# Altium schematic sheet Att_steet_2.SchDoc
size A
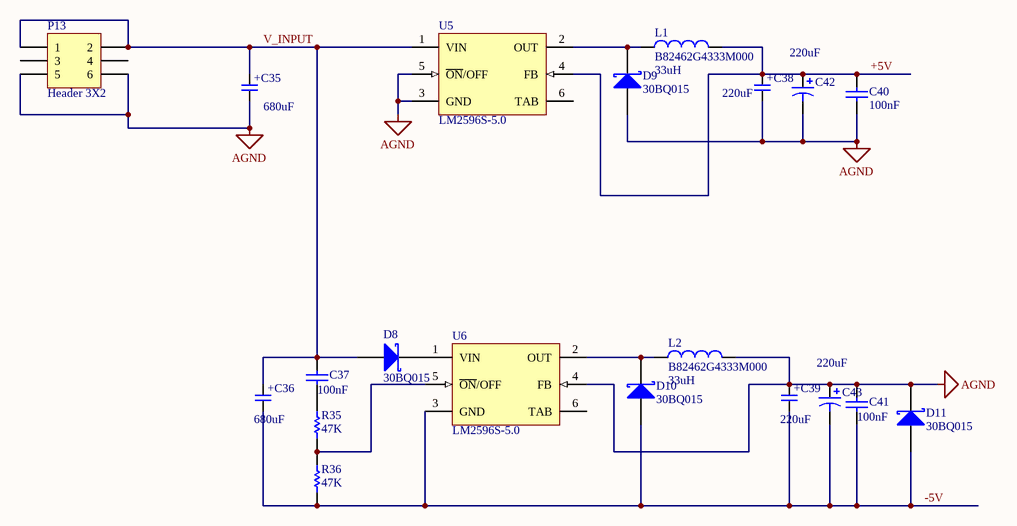
[diagram p0: Att_steet_2.SchDoc]

## Parts
C35  value 680uF  [H13]  (hidden comment: Cap)
C36  value 680uF  [H13]  (hidden comment: Cap)
C37  value 100nF  [0805]  (hidden comment: C0805)
C38  value 220uF  [H13]  (hidden comment: Cap)
C39  value 220uF  [H13]  (hidden comment: Cap)
C40  value 100nF  [0805]  (hidden comment: C0805)
C41  value 100nF  [0805]  (hidden comment: C0805)
C42  value 220uF  [E]  (hidden comment: T510E)
C43  value 220uF  [E]  (hidden comment: T510E)
D8  30BQ015  [SMC]
D9  30BQ015  [SMC]
D10  30BQ015  [SMC]
D11  30BQ015  [SMC]
L1  B82462G4333M000  value 33uH  [B82462G4]
L2  B82462G4333M000  value 33uH  [B82462G4]
P13  Header 3X2  [HDR2X3]
R35  value 47K  [0805]  (hidden comment: ERA6Y)
R36  value 47K  [0805]  (hidden comment: ERA6Y)
U5  LM2596S-5.0  [TS5B_N]
U6  LM2596S-5.0  [TS5B_N]

## Nets
AGND: C35.2 C38.2 C39.1 C40.1 C41.2 C42.2 C43.1 D9.1(A) D11.2(K) L2.2 P13.5 P13.6 U5.3(GND) U5.5(~{ON}/OFF) U6.4(FB)
+5V: C38.1 C40.2 C42.1 L1.2 U5.4(FB)
-5V: C36.2 C39.2 C41.1 C43.2 D10.1(A) D11.1(A) R36.2 U6.3(GND)
V_INPUT: C35.1 C36.1 C37.2 D8.1(A) P13.1 P13.2 U5.1(VIN)
NetC37_1: C37.1 R35.1
NetD8_2: D8.2(K) U6.1(VIN)
NetD9_2: D9.2(K) L1.1 U5.2(OUT)
NetD10_2: D10.2(K) L2.1 U6.2(OUT)
NetR35_2: R35.2 R36.1 U6.5(~{ON}/OFF)

Not connected (* = marked no-connect by the designer): P13 3 4; U5 6(TAB); U6 6(TAB)

## Notes on the sheet
- (in symbol Lyt Cap) +

## Library data of the parts
C35 C36 C38 C39 = Lyt Cap: Manufacturer: Panasonic; Type: Aluminum Lyt Cap
C37 C40 C41 = C0805: Ceramic Chip Capacitor - Standard; Note: Footprint corresponds to dimensions for bulk cassette packaging. This case size has tightened tolerances.; Published: 17-Jul-2002; LatestRevisionDate: 19-Mar-2004; LatestRevisionNote: Silkscreen size reduced.; DatasheetDocument: Mar-2001; PackageDocument: Mar-2001; PackageReference: 0805; Publisher: Altium Limited; Code_JEITA: 0805; Code_IPC: 2012[0805]; ComponentLink1Description: Manufacturer Link; ComponentLink1URL: http://www.kemet.com/; ComponentLink2Description: Datasheet; ComponentLink2URL: http://www.kemet.com/kemet/web/homepage/kechome.nsf/vapubfilesname/F3102TA.pdf/$file/F3102TA.pdf
C42 C43 = T510E: Solid Tantalum Chip Capacitor, T510 Series - Ultra-Low ESR; Published: 17-Jul-2002; LatestRevisionDate: 19-Mar-2004; LatestRevisionNote: Silkscreen dimensions re-sized.; DatasheetDocument: Mar-2001; PackageDocument: Mar-2001; PackageReference: E; Publisher: Altium Limited; Code_JEITA: 7260-38; ComponentLink1Description: Manufacturer Link; ComponentLink1URL: http://www.kemet.com/; ComponentLink2Description: Datasheet; ComponentLink2URL: http://www.kemet.com/kemet/web/homepage/kechome.nsf/vapubfilesname/F3102TA.pdf/$file/F3102TA.pdf
D8-D11 = 30BQ015: Schottky Rectifier; Published: 8-Jun-2000; LatestRevisionDate: 17-Jul-2002; LatestRevisionNote: Re-released for DXP Platform.; DatasheetDocument: PD-2.490; PackageReference: SMC; Publisher: Altium Limited; Code_JEDEC: DO-214-AB; ComponentLink1Description: Manufacturer Link; ComponentLink1URL: http://www.irf.com/; ComponentLink2Description: Datasheet; ComponentLink2URL: http://www.irf.com/product-info/datasheets/data/30bq015.pdf
L1 L2 = B82462G4333M000: SMT Power Inductor; Size 6.3×6.3×3.0mm, ±20% Tolerance, 33uH, 0.85A; PCB_Layout: Complies with manufacturer's recommendation.; Published: 26-Sep-2008; DatasheetVersion: Mar-2008; PackageVersion: Mar-2008; PackageReference: B82462G4; Publisher: Altium Limited; PackageDescription: SM Power Inductor; 2 Leads; Body 6.3 x 6.3 x 3.0 mm (LxWxH); ComponentLink1Description: Manufacturer Link; ComponentLink1URL: http://www.epcos.com/; ComponentLink2Description: Datasheet; ComponentLink2URL: http://www.epcos.com/inf/30/db/ind_2008/b82462g4.pdf
P13 = Header 3X2: Header, 3-Pin, Dual row; LatestRevisionDate: 17-Jul-2002; LatestRevisionNote: Re-released for DXP Platform.; Publisher: Altium Limited
R35 R36 = ERA6Y: Rectangular Thick Film Chip Resistor, 10 Ohm to 1M Ohm Range, 0.1% and 0.5% Tolerance, 0805 Size, 0.1 W; Note: If flow soldering, adjust pad width of PCB Footprint to 0.7 - 0.8 times the width of the resistor.; Published: 17-Dec-2003; LatestRevisionDate: 19-Mar-2004; LatestRevisionNote: Silkscreen size reduced.; PackageReference: ERA-0805; Publisher: Altium Limited; PackageDocument: Mar-2003; Code_IPC: 2012 [0805]; ComponentLink1Description: Manufacturer Link; ComponentLink1URL: http://www.panasonic.com/industrial/components/resistive_products.htm; ComponentLink2Description: Datasheet; ComponentLink2URL: http://www.panasonic.com/industrial/components/pdf/AOA0000CE8.pdf
U5 U6 = LM2596S-5.0: SIMPLE SWITCHER Power Converter 150 KHz 3A Step-Down Voltage Regulator; Manufacturer: National Semiconductor; PackageTopMarking: NSUZXYTT*LM2596S*-5.0 P+; PowerWise: N; Published: 4-Dec-2008; DatasheetVersion: May-2002; PackageVersion: revD, Apr-2005; PackageReference: TS5B; Publisher: Altium Limited; PackageDescription: TO-263, Molded, .400 x .390 x .180in, 5 Lead, .067in Pitch, Surface Mount; CompType: Switcher; PartNumber: LM2596S-5.0; RoHS: O; PinCount: 5; DigiKeyPartNumber: LM2596S-5.0-ND; Code_JEDEC: MO-169-AB; ComponentLink1Description: LM2596 Datasheet; ComponentLink1URL: http://www.national.com/ds/LM/LM2596.pdf; ComponentLink2Description: LM2596 Web Page; ComponentLink2URL: http://www.national.com/pf/LM/LM2596.html; ComponentLink3Description: TS5B Package Page; ComponentLink3URL: http://www.national.com/packaging/folders/ts5b.html